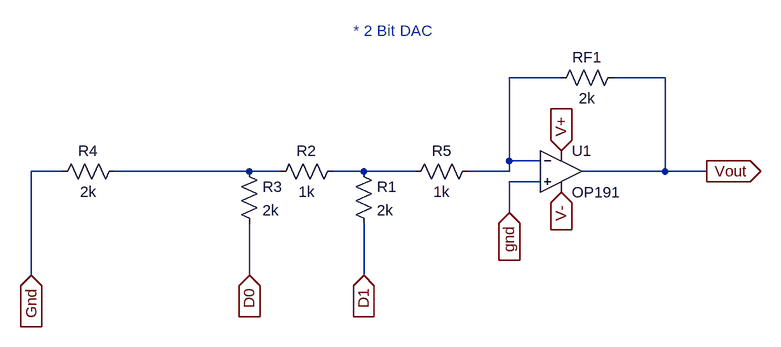
[diagram p0: schematic 2bitDAC.asc]
2bitDAC.asc, the LTspice schematic file:
Version 4
SHEET 1 880 680
WIRE 464 -112 384 -112
WIRE 624 -112 544 -112
WIRE 384 16 384 -112
WIRE 432 16 384 16
WIRE -304 32 -352 32
WIRE -16 32 -224 32
WIRE 32 32 -16 32
WIRE 160 32 112 32
WIRE 240 32 160 32
WIRE 384 32 384 16
WIRE 384 32 320 32
WIRE 624 32 624 -112
WIRE 624 32 496 32
WIRE 688 32 624 32
WIRE 432 48 384 48
WIRE 384 96 384 48
WIRE -352 192 -352 32
WIRE -16 192 -16 112
WIRE 160 192 160 112
FLAG 464 0 V+
IOPIN 464 0 In
FLAG 464 64 V-
IOPIN 464 64 In
FLAG 688 32 Vout
IOPIN 688 32 Out
FLAG -16 192 D0
IOPIN -16 192 In
FLAG 160 192 D1
IOPIN 160 192 In
FLAG -352 192 Gnd
IOPIN -352 192 In
FLAG 384 96 gnd
IOPIN 384 96 In
SYMBOL res 144 16 R0
SYMATTR InstName R1
SYMATTR Value 2k
SYMATTR SpiceLine tol=5kohms
SYMBOL res 128 16 R90
WINDOW 0 0 56 VBottom 2
WINDOW 3 32 56 VTop 2
SYMATTR InstName R2
SYMATTR Value 1k
SYMATTR SpiceLine tol=5kohms
SYMBOL res -32 16 R0
SYMATTR InstName R3
SYMATTR Value 2k
SYMATTR SpiceLine tol=5kohms
SYMBOL res -208 16 R90
WINDOW 0 0 56 VBottom 2
WINDOW 3 32 56 VTop 2
SYMATTR InstName R4
SYMATTR Value 2k
SYMBOL res 560 -128 R90
WINDOW 0 0 56 VBottom 2
WINDOW 3 32 56 VTop 2
SYMATTR InstName RF1
SYMATTR Value 2k
SYMBOL OpAmps\\OP191 464 -32 R0
SYMATTR InstName U1
SYMBOL res 336 16 R90
WINDOW 0 0 56 VBottom 2
WINDOW 3 32 56 VTop 2
SYMATTR InstName R5
SYMATTR Value 1k
TEXT 144 -184 Left 2 ;* 2 Bit DAC

The netlist it stands for:
* 2bitDAC.asc
R1 N003 D1 2k tol=5kohms
R2 N003 N002 1k tol=5kohms
R3 N002 D0 2k tol=5kohms
R4 N002 Gnd 2k
RF1 Vout N001 2k
XU1 Gnd N001 V+ V- Vout OP191  ; pins In+ In- V+ V- OUT
R5 N001 N003 1k
* * 2 Bit DAC
.lib ADI.lib
.backanno
.end